# EAGLE design EXIST_1U_Intellijel_PCB (EAGLE 9.1.3)
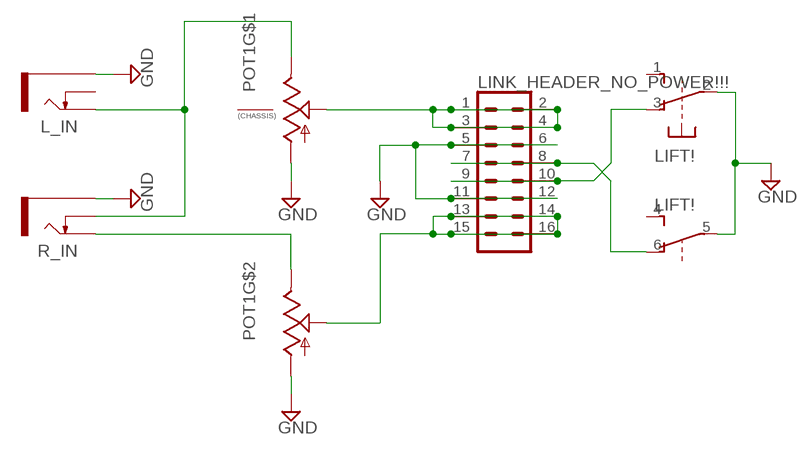
[diagram p0: schematic, sheet 1]

## Parts
L_IN  THONKICONNNEW  [WQP-PJ301M-12_JACK]
LIFT!  9450-2  [9450-2]
LINK_HEADER_NO_POWER!!!  CONN_08X2  [2X8]
POT1  ALPHA-9MM-DUALPOT  [DUAL_9MM_SNAP-IN_POT]
R_IN  THONKICONNNEW  [WQP-PJ301M-12_JACK]

## Nets
GND: L_IN.P$3_SLEEVE(SLEEVE) LIFT!.2(1:P) LIFT!.5(2:P) LINK_HEADER_NO_POWER!!!.5 LINK_HEADER_NO_POWER!!!.6 LINK_HEADER_NO_POWER!!!.11 LINK_HEADER_NO_POWER!!!.12 POT1.1(A) POT1.1B(A) R_IN.P$3_SLEEVE(SLEEVE)
N$1: LINK_HEADER_NO_POWER!!!.13 LINK_HEADER_NO_POWER!!!.14 LINK_HEADER_NO_POWER!!!.15 LINK_HEADER_NO_POWER!!!.16 POT1.2B(S)
N$2: LINK_HEADER_NO_POWER!!!.1 LINK_HEADER_NO_POWER!!!.2 LINK_HEADER_NO_POWER!!!.3 LINK_HEADER_NO_POWER!!!.4 POT1.2(S)
N$3: LIFT!.6(2:O) LINK_HEADER_NO_POWER!!!.7 LINK_HEADER_NO_POWER!!!.8
N$5: LIFT!.3(1:O) LINK_HEADER_NO_POWER!!!.9 LINK_HEADER_NO_POWER!!!.10
N$6: POT1.3B(E) R_IN.P$1_TIP(TIP)
N$7: L_IN.P$1_TIP(TIP) POT1.3(E) R_IN.P$2_SWITCH(SWITCH)
Unconnected: L_IN.P$2_SWITCH(SWITCH) LIFT!.1(1:S) LIFT!.4(2:S) POT1.CHASSIS1 POT1.CHASSIS2

## Library data of the parts
L_IN R_IN = MusicThingModular:THONKICONN: 3.5mm socket for Eurorack modular synths
LIFT! = switch-misc:9450-2: MARQUARDT SWITCH
LINK_HEADER_NO_POWER!!! = SparkFun-Connectors:CONN_08X2: Multi connection point. Often used as Generic Header-pin footprint for 0.1 inch spaced/style header connections You can populate with any combo of single row headers, but if you'd like an exact match, check this: Header - 2x8 (Male, 0.1") <https://www.sparkfun.com/products/13156> (PRT-13156) On any of the 0.1 inch spaced packages, you can populate with these: Break Away Headers - Straight <https://www.sparkfun.com/products/116> (PRT-00116) Break Away Male Headers - Right Angle <https://www.sparkfun.com/products/553> (PRT-00553) Female Headers <https://www.sparkfun.com/products/115> (PRT-00115) Break Away Headers - Machine Pin <https://www.sparkfun.com/products/117> (PRT-00117) Break Away Female Headers - Swiss Machine Pin <https://www.sparkfun.com/products/743> (PRT-00743)
POT1 = MusicThingModular:ALPHA-9MM-DUALPOT: 9mm vertical snap-in pot, Alpha / Panasonic style, with a connection to the metal chassis for grounding

## Board
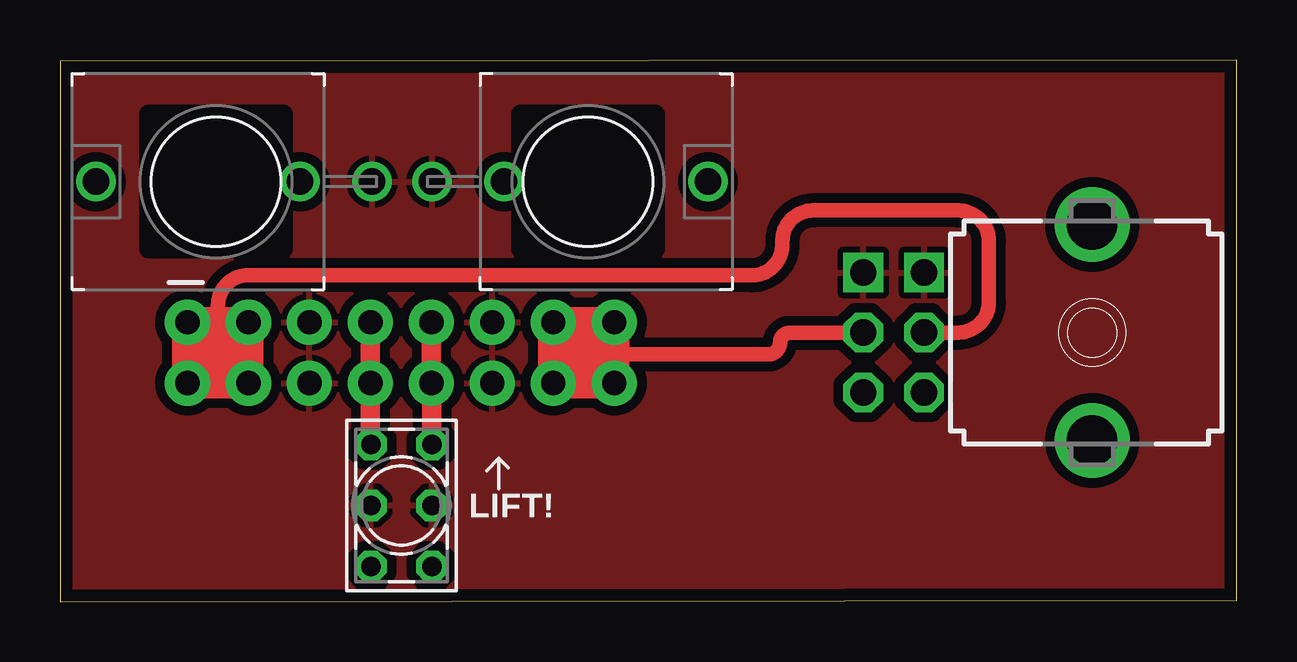
[diagram p1: board, top side]
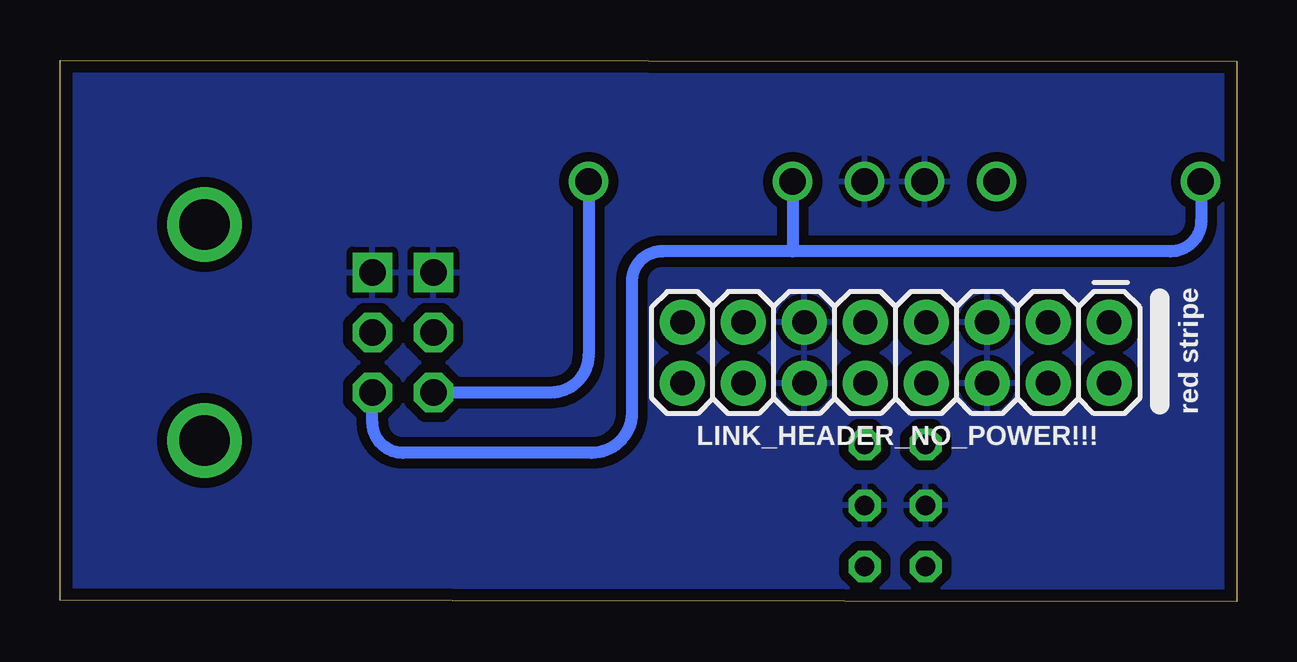
[diagram p2: board, bottom side, seen from below]

Size 49.02 x 22.57 mm. Coordinates in mm from the lower left corner, seen from the top.
Outline: 0,0 49.02,0.05 49.02,22.57 0,22.52 0,0
Copper layers (1*16): Top 0.035mm / dielectric 1.5mm / Bottom 0.035mm
Design rules "default *": minimum track width 6mil, minimum drill 0.35mm, track to track 6mil, track to pad 6mil, pad to pad 6mil, via to via 6mil, smd to smd 6mil, copper to edge 20mil, drill to drill 6mil, minimum pad ring 10mil, minimum via ring 8mil, stop-mask expansion 4mil, vias tented up to drill 0mil, thermal gap 10mil

### Footprints (pad centres in the part's own frame; a part is rotated, then mirrored left to right if it is on the bottom)
WQP-PJ301M-12_JACK = drill 1.1: P$1_TIP 0,5; P$2_SWITCH 0,-3.5; P$3_SLEEVE 0,-6.5
9450-2 = drill 0.813 octagon: 1 -2.54,-1.27; 2 0,-1.27; 3 2.54,-1.27; 4 -2.54,1.27; 5 0,1.27; 6 2.54,1.27
2X8 = drill 1.016 pad 1.88: 1 0,0; 2 0,2.54; 3 2.54,0; 4 2.54,2.54; 5 5.08,0; 6 5.08,2.54; 7 7.62,0; 8 7.62,2.54; 9 10.16,0; 10 10.16,2.54; 11 12.7,0; 12 12.7,2.54; 13 15.24,0; 14 15.24,2.54; 15 17.78,0; 16 17.78,2.54
DUAL_9MM_SNAP-IN_POT = drill 1.1 square: 1 -2.5,-7; 1B -2.5,-9.54 | drill 1.1 octagon: 2 0,-7; 2B 0,-9.54; 3 2.5,-7; 3B 2.5,-9.54 | drill 2.1 pad 2.54: CHASSIS1 -4.5,0; CHASSIS2 4.5,0

### Placement (x,y rotation side)
L_IN  6.5,17.5 90 top
LIFT!  14.22,4.01 90 top
LINK_HEADER_NO_POWER!!!  5.31,11.64 180 bottom
POT1  43.01,11.21 270 top
R_IN  22,17.5 270 top

### Tracks (layer width: path | path; a pad name or v marks a point on that pad's centre or on a via)
GND
  pour Bottom (isolate 0.406): 0,0 0,22.36 49,22.36 49,0
  pour Top (isolate 0.406): 0.07,0 0.07,22.23 49.03,22.23 49.03,0
N$1
  Top 0.61: 21.85,10.3 21.85,10.35 | 21.82,10.38 arc90 21.9,10.3 29.5,10.3 arc90 30,10.8 arc-90 30.4,11.2 33.45,11.2 POT1.2B
  Top 1.27: LINK_HEADER_NO_POWER!!!.13 LINK_HEADER_NO_POWER!!!.15 | LINK_HEADER_NO_POWER!!!.15 LINK_HEADER_NO_POWER!!!.16 | LINK_HEADER_NO_POWER!!!.16 LINK_HEADER_NO_POWER!!!.14 | LINK_HEADER_NO_POWER!!!.14 LINK_HEADER_NO_POWER!!!.13 | LINK_HEADER_NO_POWER!!!.13 21.85,10.35 LINK_HEADER_NO_POWER!!!.16 | LINK_HEADER_NO_POWER!!!.14 21.82,10.38 LINK_HEADER_NO_POWER!!!.15
N$2
  Top 0.61: POT1.2 37.43,11.21 arc90 38.7,12.48 38.7,15.03 arc90 37.43,16.3 31.37,16.3 arc90 30.1,15.03 30.1,14.87 arc-90 28.83,13.6 7.85,13.6 arc90 6.58,12.33 6.58,10.38
  Top 1.27: LINK_HEADER_NO_POWER!!!.1 LINK_HEADER_NO_POWER!!!.3 | LINK_HEADER_NO_POWER!!!.3 LINK_HEADER_NO_POWER!!!.4 | LINK_HEADER_NO_POWER!!!.4 LINK_HEADER_NO_POWER!!!.2 | LINK_HEADER_NO_POWER!!!.2 LINK_HEADER_NO_POWER!!!.1 | LINK_HEADER_NO_POWER!!!.1 6.58,10.38 LINK_HEADER_NO_POWER!!!.4 | LINK_HEADER_NO_POWER!!!.2 LINK_HEADER_NO_POWER!!!.3
N$3
  Top 0.813: LINK_HEADER_NO_POWER!!!.7 LINK_HEADER_NO_POWER!!!.8 12.93,6.6 arc45 LIFT!.6
N$5
  Top 0.813: LINK_HEADER_NO_POWER!!!.9 LINK_HEADER_NO_POWER!!!.10 arc-45 15.49,9.05 LIFT!.3
N$6
  Bottom 0.508: R_IN.P$1_TIP 27,10.28 arc90 28.57,8.71 POT1.3B
N$7
  Bottom 0.508: L_IN.P$1_TIP 1.48,15.89 arc91 2.75,14.6 18.5,14.6 | 18.5,14.6 23.93,14.6 arc-90 25.2,13.33 25.2,7.87 arc90 26.87,6.2 34.74,6.2 arc90 36.01,7.47 POT1.3 | R_IN.P$2_SWITCH 18.5,17.49 18.5,14.6

### Text on the board
bNames: red stripe